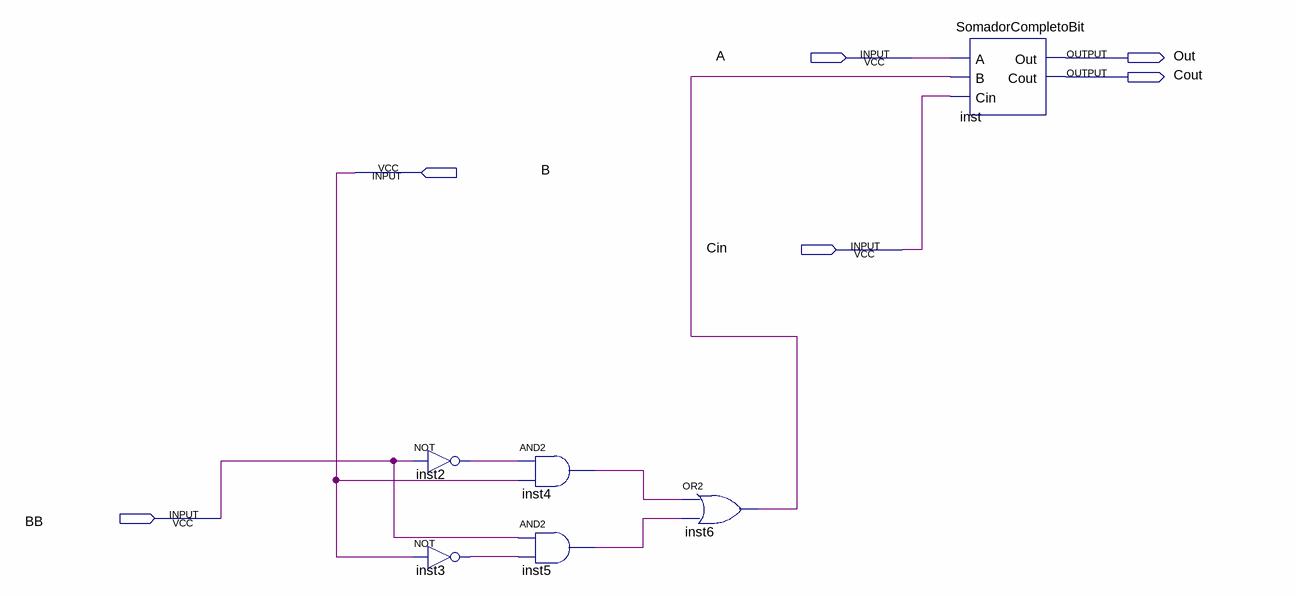
[diagram p0: schematic sheet]
// Quartus schematic SubtratorBit.bdf as structural Verilog: 6 symbols, 6 pins
module SubtratorBit (
  input  A,
  input  B,
  input  Cin,
  input  BB,
  output Out,
  output Cout
);

  wire inst2_out, inst3_out, inst4_out, inst5_out, inst6_out;

  not inst2 (inst2_out, BB);
  not inst3 (inst3_out, B);
  and inst4 (inst4_out, inst2_out, B);
  and inst5 (inst5_out, BB, inst3_out);
  or inst6 (inst6_out, inst4_out, inst5_out);
  SomadorCompletoBit inst (.A(A), .B(inst6_out), .Cin(Cin), .Out(Out), .Cout(Cout));
endmodule
